# Altium project EXIO_v2_0.PrjPCB
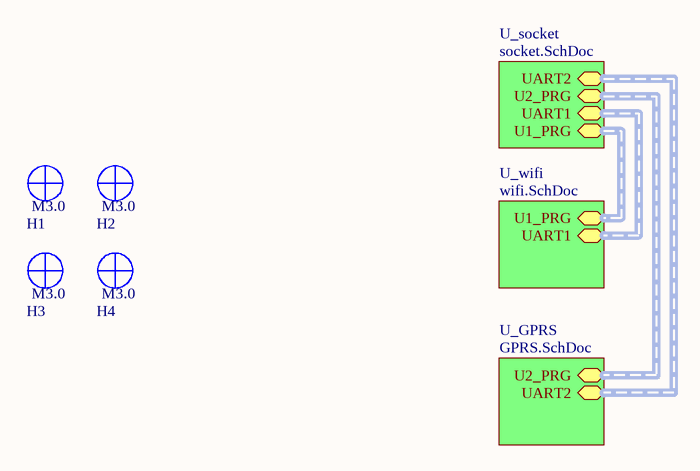
[diagram p0: layout.SchDoc]
4 sheets, 34 parts. Net scope: hierarchical (ports join the sheet entries above them; power ports are global).
Board file: exio_v2_0.PcbDoc
Sheets:
  layout.SchDoc
    U_socket = socket.SchDoc
    U_GPRS = GPRS.SchDoc
    U_wifi = wifi.SchDoc

## Sheet layout.SchDoc
size A4

### Parts
H1  M3.0  [SCREW_HOLE_3.5]  (value not drawn)  (no BOM)
H2  M3.0  [SCREW_HOLE_3.5]  (value not drawn)  (no BOM)
H3  M3.0  [SCREW_HOLE_3.5]  (value not drawn)  (no BOM)
H4  M3.0  [SCREW_HOLE_3.5]  (value not drawn)  (no BOM)

### Sub-sheets
U_GPRS = GPRS.SchDoc: U2_PRG (harness U2_PRG), UART2 (harness UART2)
U_socket = socket.SchDoc: UART2 (harness UART2), U2_PRG (harness U2_PRG), UART1 (harness UART1), U1_PRG (harness U1_PRG)
U_wifi = wifi.SchDoc: U1_PRG (harness U1_PRG), UART1 (harness UART1)

### Buses and harness runs
harness sheet U_GPRS/U2_PRG = sheet U_socket/U2_PRG
harness sheet U_GPRS/UART2 = sheet U_socket/UART2
harness sheet U_socket/U1_PRG = sheet U_wifi/U1_PRG
harness sheet U_socket/UART1 = sheet U_wifi/UART1

### Library data of the parts
H1-H4 = SCRE_HOLE_3.2: Screw hole for M3.0

## Sheet socket.SchDoc
size A4
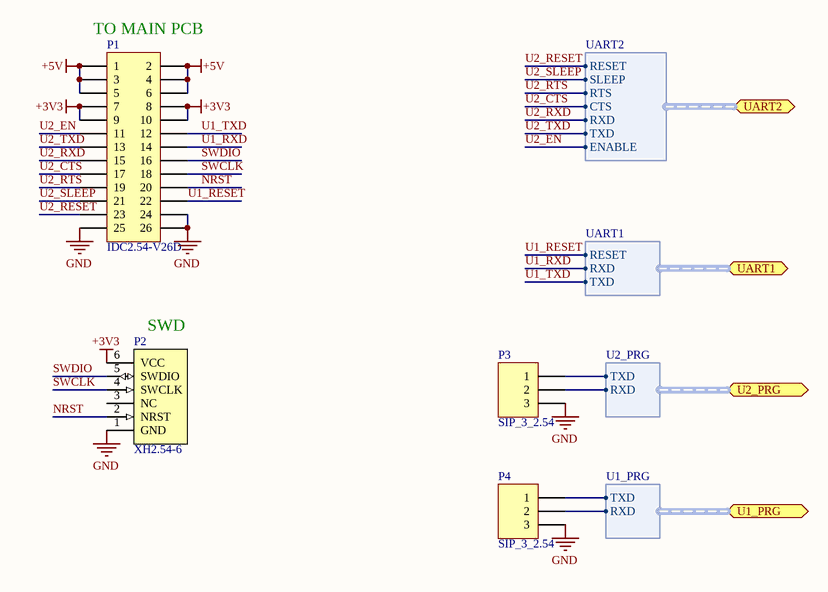
[diagram p1: socket.SchDoc]

### Parts
P1  IDC2.54-V26D  [IDC2.54-V26D]
P2  XH2.54-6  [REAL_SIP6_2.54]
P3  SIP_3_2.54  [REAL_SIP3_2.54]  (no BOM)
P4  SIP_3_2.54  [REAL_SIP3_2.54]  (no BOM)

### Ports
U1_PRG (harness U1_PRG), U2_PRG (harness U2_PRG), UART1 (harness UART1), UART2 (harness UART2)

### Harnesses
UART2: ENABLE, TXD, RXD, CTS, RTS, SLEEP, RESET
U2_PRG: TXD, RXD
UART1: TXD, RXD, RESET
U1_PRG: TXD, RXD

### Nets
+3V3: P1.7 P1.8 P1.9 P1.10 P2.6(VCC)
+5V: P1.1 P1.2 P1.3 P1.4 P1.5 P1.6
GND: P1.24 P1.25 P1.26 P2.1(GND) P3.3 P4.3
HST_RXD: P3.2 ; port U2_PRG.RXD
HST_TXD: P3.1 ; port U2_PRG.TXD
NRST: P1.20 P2.2(NRST)
SWCLK: P1.18 P2.4(SWCLK)
SWDIO: P1.16 P2.5(SWDIO)
U1_RESET: P1.22 ; port UART1.RESET
U1_RXD: P1.14 ; port UART1.RXD
U1_TXD: P1.12 ; port UART1.TXD
U2_CTS: P1.17 ; port UART2.CTS
U2_EN: P1.11 ; port UART2.ENABLE
U2_RESET: P1.23 ; port UART2.RESET
U2_RTS: P1.19 ; port UART2.RTS
U2_RXD: P1.15 ; port UART2.RXD
U2_SLEEP: P1.21 ; port UART2.SLEEP
U2_TXD: P1.13 ; port UART2.TXD
NetJP2_1: P4.1 ; port U1_PRG.TXD
NetJP2_3: P4.2 ; port U1_PRG.RXD

Not connected (* = marked no-connect by the designer): P2 3(NC)

### Notes on the sheet
- (near P1) TO MAIN PCB
- (near P2) SWD

### Library data of the parts
P1 = Header 13X2: IDC2.54-13x2 Header; LatestRevisionDate: 17-Jul-2002; LatestRevisionNote: Re-released for DXP Platform.; Publisher: Altium Limited; Price: 0.38
P2 = SWD-Connector: SW debug connector
P3 P4 = Header 3: Header, 3-Pin; LatestRevisionDate: 17-Jul-2002; LatestRevisionNote: Re-released for DXP Platform.; Publisher: Altium Limited

## Sheet GPRS.SchDoc
size A4
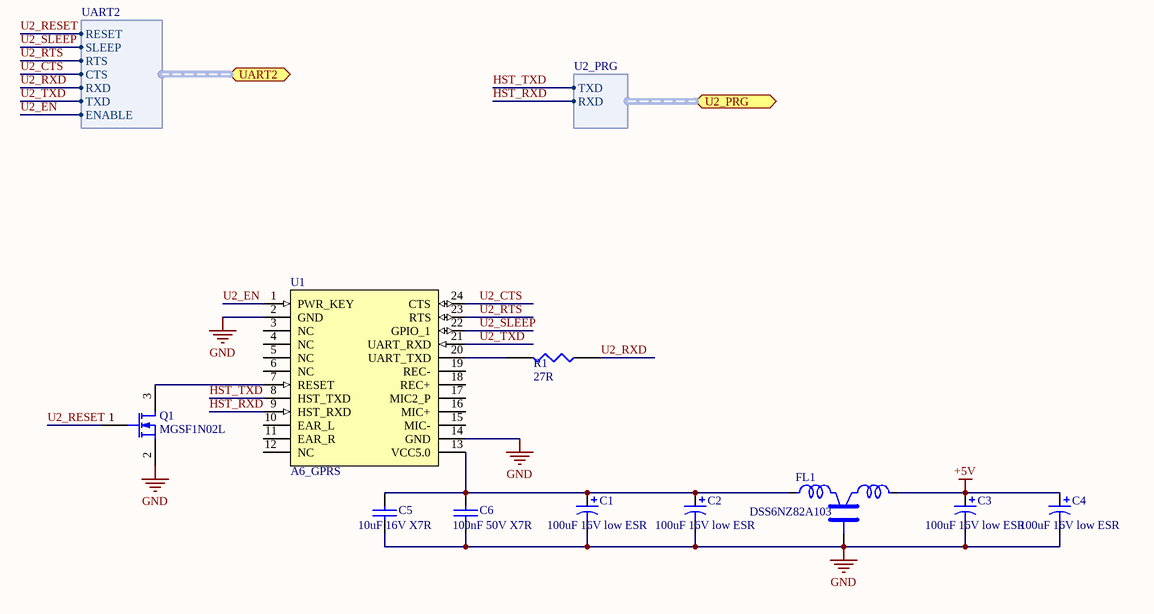
[diagram p2: GPRS.SchDoc]

### Parts
C1  100uF 16V low ESR  [CAPPR2-5x11]
C2  100uF 16V low ESR  [CAPPR2-5x11]
C3  100uF 16V low ESR  [CAPPR2-5x11]
C4  100uF 16V low ESR  [CAPPR2-5x11]
C5  10uF 16V X7R  [CAPC3216N]
C6  100nF 50V X7R  [CAPC2012N]
FL1  DSS6NZ82A103  [DSS6]
Q1  MGSF1N02L  [SOT23-3N]
R1  27R  [RESC2012N]
U1  A6_GPRS  [A6_GPRS_MOD]

### Ports
U2_PRG (harness U2_PRG), UART2 (harness UART2)

### Harnesses
U2_PRG: TXD, RXD
UART2: ENABLE, TXD, RXD, CTS, RTS, SLEEP, RESET

### Nets
+5V: C3.1 C4.1 FL1.3
GND: C1.2 C2.2 C3.2 C4.2 C5.2 C6.2 FL1.2 Q1.2(S) U1.2(GND) U1.14(GND)
HST_RXD: U1.9(HST_RXD) ; port U2_PRG.RXD
HST_TXD: U1.8(HST_TXD) ; port U2_PRG.TXD
U2_CTS: U1.24(CTS) ; port UART2.CTS
U2_EN: U1.1(PWR_KEY) ; port UART2.ENABLE
U2_RESET: Q1.1(G) ; port UART2.RESET
U2_RTS: U1.23(RTS) ; port UART2.RTS
U2_RXD: R1.1 ; port UART2.RXD
U2_SLEEP: U1.22(GPIO_1) ; port UART2.SLEEP
U2_TXD: U1.21(UART_RXD) ; port UART2.TXD
NetC1_1: C1.1 C2.1 C5.1 C6.1 FL1.1 U1.13(VCC5.0)
NetQ1_3: Q1.3(D) U1.7(RESET)
NetR1_2: R1.2 U1.20(UART_TXD)

Not connected (* = marked no-connect by the designer): U1 3(NC) 4(NC) 5(NC) 6(NC) 10(EAR_L) 11(EAR_R) 12(NC) 15(MIC-) 16(MIC+) 17(MIC2_P) 18(REC+) 19(REC-)

### Library data of the parts
C1-C4 = Cap Pol1: Polarized Capacitor (Radial); Price: 0.38
C5 C6 = CAP: Price: 0.025
FL1 = DSS6: Murata EMI suppression filter; Manufacturer: Murata; Price: 0.5
Q1 = MOSFET-N: N-Channel MOSFET; PackageDocument: 1995/1996; Published: 8-Jun-2000; LatestRevisionDate: 17-Jul-2002; LatestRevisionNote: Re-released for DXP Platform.; PackageReference: E3; Publisher: Altium Limited; Price: 0.65
R1 = RES1
U1 = A6_GPRS_Module: GPRS module; Manufacturer: Ai ThinkerTecnology; Price: 23.8

## Sheet wifi.SchDoc
size A4
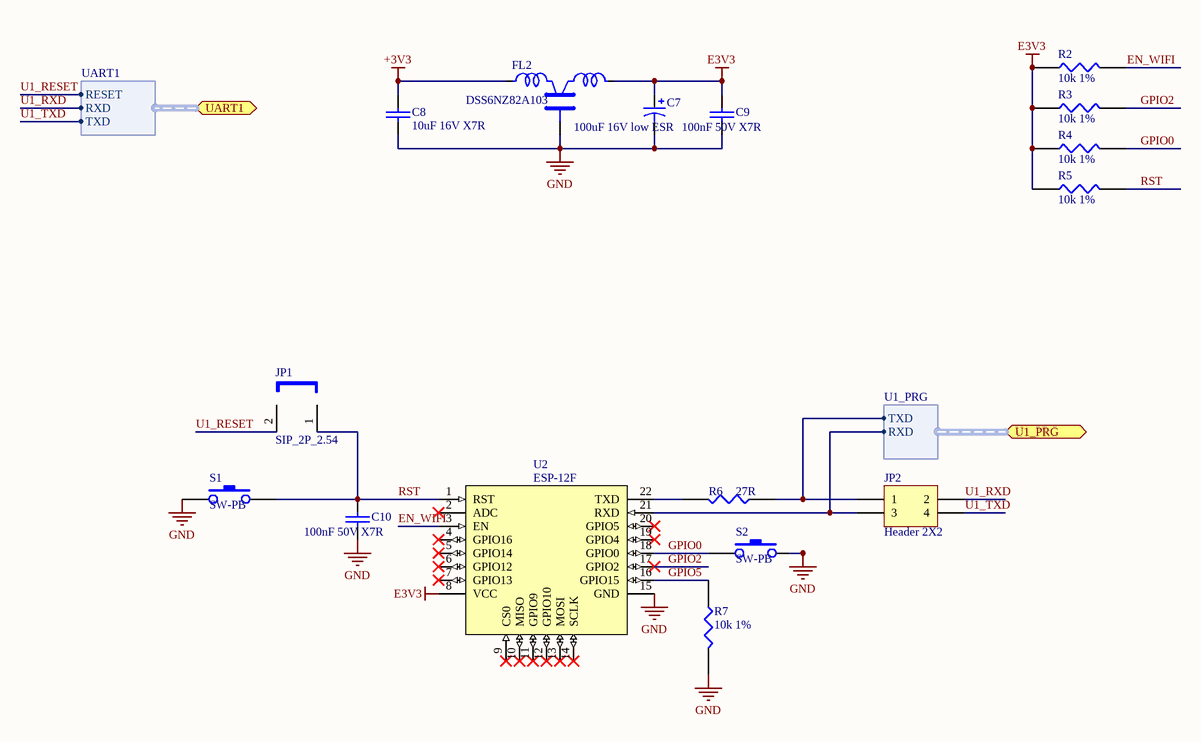
[diagram p3: wifi.SchDoc]

### Parts
C7  100uF 16V low ESR  [CAPPR2-5x11]
C8  10uF 16V X7R  [CAPC3216N]
C9  100nF 50V X7R  [CAPC2012N]
C10  100nF 50V X7R  [CAPC2012N]
FL2  DSS6NZ82A103  [DSS6]
JP1  SIP_2P_2.54  [JP2-P2.54]
JP2  Header 2X2  [HDR2X2]
R2  10k 1%  [RESC2012N]
R3  10k 1%  [RESC2012N]
R4  10k 1%  [RESC2012N]
R5  10k 1%  [RESC2012N]
R6  27R  [RESC2012N]
R7  10k 1%  [RESC2012N]
S1  SW-PB  [SW5X7]  (no BOM)
S2  SW-PB  [SW5X7]  (no BOM)
U2  ESP-12F  [ESP-12F]

### Ports
U1_PRG (harness U1_PRG), UART1 (harness UART1)

### Harnesses
U1_PRG: TXD, RXD
UART1: TXD, RXD, RESET

### Nets
+3V3: C8.1 FL2.1
E3V3: C7.1 C9.1 FL2.3 R2.1 R3.1 R4.1 R5.1 U2.8(VCC)
GND: C7.2 C8.2 C9.2 C10.2 FL2.2 R7.2 S1.1 S2.2 U2.15(GND)
EN_WIFI: R2.2 U2.3(EN)
GPIO0: R4.2 S2.1 U2.18(GPIO0)
GPIO2: R3.2 U2.17(GPIO2)
GPIO5: R7.1 U2.16(GPIO15)
RST: C10.1 JP1.1 R5.2 S1.2 U2.1(RST)
U1_RESET: JP1.2 ; port UART1.RESET
U1_RXD: JP2.2 ; port UART1.RXD
U1_TXD: JP2.4 ; port UART1.TXD
NetJP2_1: JP2.1 R6.1 ; port U1_PRG.TXD
NetJP2_3: JP2.3 U2.21(RXD) ; port U1_PRG.RXD
NetR6_2: R6.2 U2.22(TXD)

Not connected (* = marked no-connect by the designer): U2 2(ADC)* 4(GPIO16)* 5(GPIO14)* 6(GPIO12)* 7(GPIO13)* 9(CS0)* 10(MISO)* 11(GPIO9)* 12(GPIO10)* 13(MOSI)* 14(SCLK)* 19(GPIO4)* 20(GPIO5)*

### Library data of the parts
C7 = Cap Pol1: Polarized Capacitor (Radial); Price: 0.38
C8-C10 = CAP: Price: 0.025
FL2 = DSS6: Murata EMI suppression filter; Manufacturer: Murata; Price: 0.5
JP1 = JUMPER
JP2 = Header 2X2: Header, 2-Pin, Dual row; LatestRevisionDate: 17-Jul-2002; LatestRevisionNote: Re-released for DXP Platform.; Publisher: Altium Limited
R2-R7 = RES1
U2 = ESP-12F: Wi-Fi module; Manufacturer: Ai-Thinker; Price: 11.8

## Nets that join several sheets
+3V3: socket (5 pins), wifi (C8.1 FL2.1)
+5V: socket (6 pins), GPRS (C3.1 C4.1 FL1.3)
GND: socket (6 pins), GPRS (10 pins), wifi (9 pins)
HST_RXD: socket (P3.2), GPRS (U1.9)
HST_TXD: socket (P3.1), GPRS (U1.8)
NetJP2_1: socket (P4.1), wifi (JP2.1 R6.1)
NetJP2_3: socket (P4.2), wifi (JP2.3 U2.21)
U1_RESET: socket (P1.22), wifi (JP1.2)
U1_RXD: socket (P1.14), wifi (JP2.2)
U1_TXD: socket (P1.12), wifi (JP2.4)
U2_CTS: socket (P1.17), GPRS (U1.24)
U2_EN: socket (P1.11), GPRS (U1.1)
U2_RESET: socket (P1.23), GPRS (Q1.1)
U2_RTS: socket (P1.19), GPRS (U1.23)
U2_RXD: socket (P1.15), GPRS (R1.1)
U2_SLEEP: socket (P1.21), GPRS (U1.22)
U2_TXD: socket (P1.13), GPRS (U1.21)